# Altium project CW342_KintexK410_676.PrjPcb (part 2 of 2)
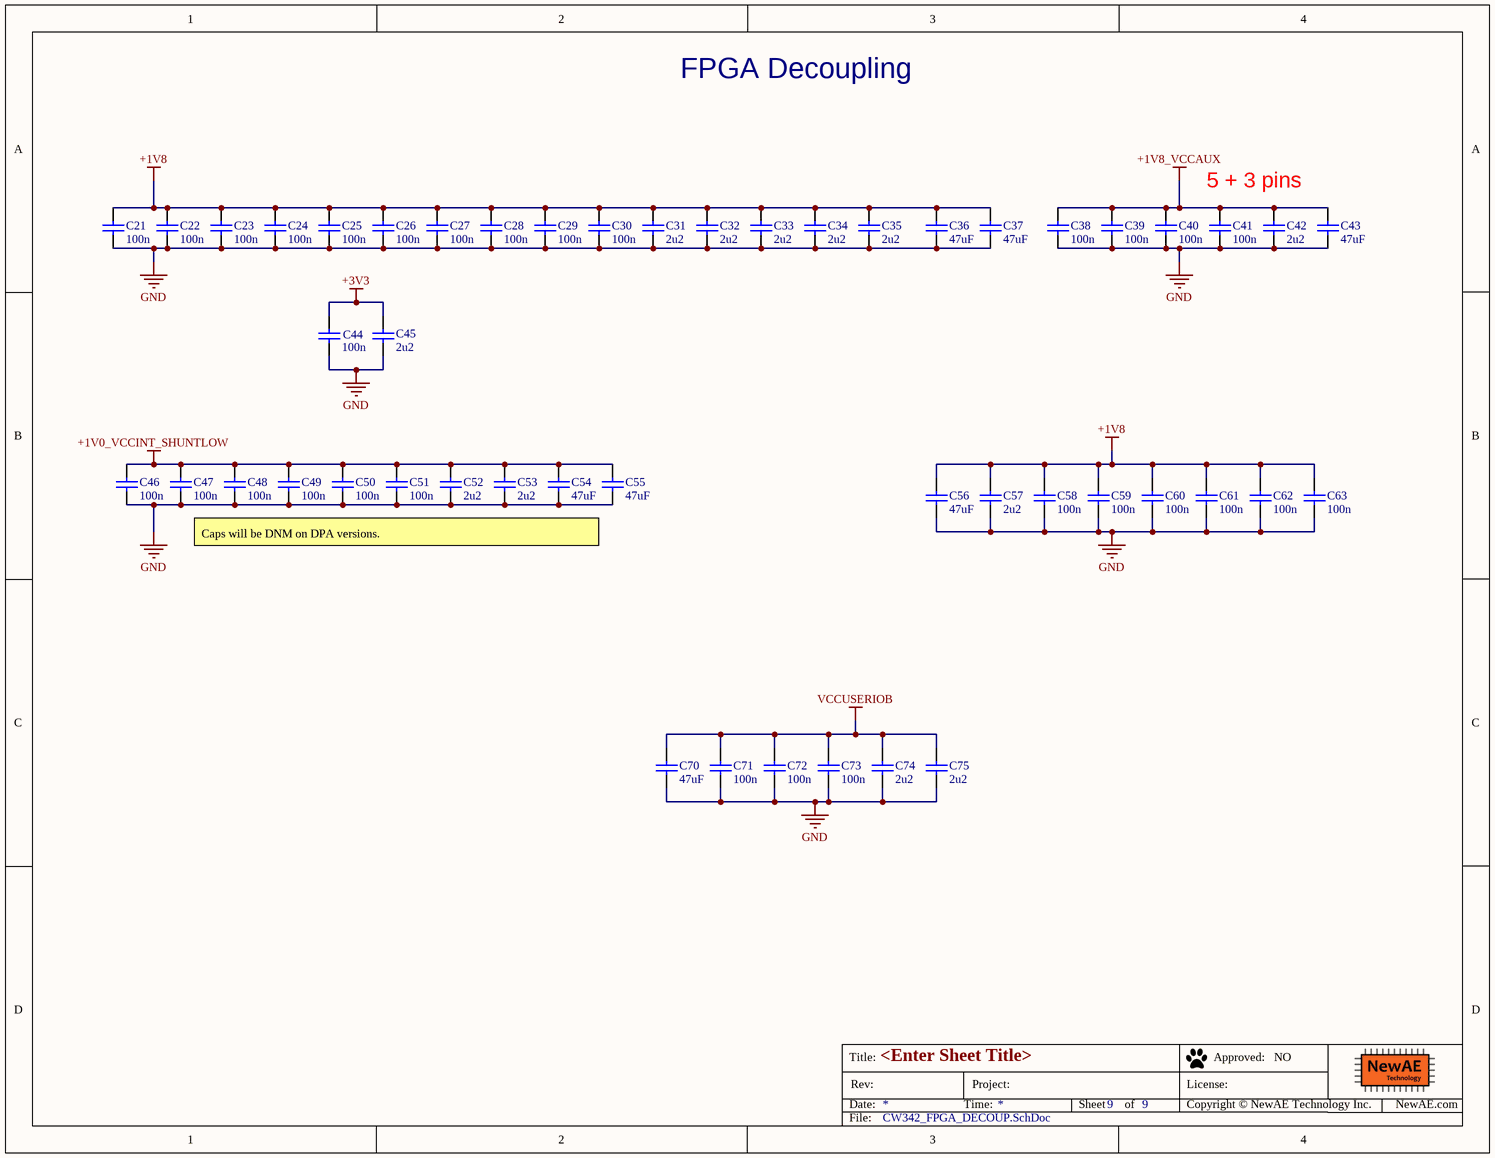
[diagram p9: CW342_FPGA_DECOUP.SchDoc]

## Nets that join several sheets
+1V0_VCCINT_SHUNTLOW: CW342_Edge (PWR1.23 PWR1.24 PWR1.25), CW342_FPGA_PWR (20 pins), CW342_FPGA_DECOUP (10 pins)
+1V8: CW342_Edge (P1.A7 P1.A8), CW342_FPGA_CFG (J1.2), CW342_FPGA_PWR (53 pins), CW342_FPGA_DECOUP (31 pins)
+1V85_XADC_VCC: CW342_XADC (7 pins), CW342_FPGA_PWR (C20.1 U5.M12)
+3V3: CW342_Edge (P1.A3 P1.A4), CW342_XADC (C1.1 L1.1), CW342_FPGA_DECOUP (C44.1 C45.1)
GND: CW342_Edge (42 pins), CW342_XADC (C1.2 L2.1), CW342_FPGAIO_1 (R15.2 R?.2), CW342_FPGA_MGT (U5.M5 U5.M6), CW342_FPGA_CFG (8 pins), CW342_FPGA_PWR (121 pins), CW342_FPGA_DECOUP (49 pins)
VCCUSERIOB: CW342_Edge (P1.B11), CW342_FPGA_PWR (7 pins), CW342_FPGA_DECOUP (6 pins)
XADC_VREFN: CW342_Edge (P1.A16 P1.B16), CW342_XADC (20 pins), CW342_FPGIO_2 (U5.A17 U5.A19 U5.B16 U5.F15), CW342_FPGA_CFG (C18.2 U5.N11), CW342_FPGA_PWR (C20.2 U5.M11)
/USB_CE: CW342_Edge (P1.A81), CW342_FPGAIO_1 (U5.N26)
/USB_RD: CW342_Edge (P1.A80), CW342_FPGAIO_1 (U5.P26)
AD0P: CW342_XADC (R6.2), CW342_FPGIO_2 (U5.C16)
AD1P: CW342_XADC (R3.2), CW342_FPGIO_2 (U5.B17)
AD3P: CW342_XADC (R12.2), CW342_FPGIO_2 (U5.G15)
AD8P: CW342_XADC (R9.2), CW342_FPGIO_2 (U5.A18)
CFG_CLK: CW342_Edge (P1.A57), CW342_FPGA_CFG (U5.C8)
CFG_D0: CW342_Edge (P1.A59), CW342_FPGAIO_1 (U5.B24)
CFG_D1: CW342_Edge (P1.B61), CW342_FPGAIO_1 (U5.A25)
CFG_D2: CW342_Edge (P1.A60), CW342_FPGAIO_1 (U5.B22)
CFG_D3: CW342_Edge (P1.B62), CW342_FPGAIO_1 (U5.A22)
CFG_D4: CW342_Edge (P1.A61), CW342_FPGAIO_1 (U5.A23)
CFG_D5: CW342_Edge (P1.B63), CW342_FPGAIO_1 (U5.A24)
CFG_D6: CW342_Edge (P1.A62), CW342_FPGAIO_1 (U5.D26)
CFG_D7: CW342_Edge (P1.B64), CW342_FPGAIO_1 (U5.C26)
CFG_D8_A0: CW342_Edge (P1.A63), CW342_FPGAIO_1 (U5.C24)
CFG_D9_A1: CW342_Edge (P1.B65), CW342_FPGAIO_1 (U5.D21)
CFG_D10_A2: CW342_Edge (P1.A64), CW342_FPGAIO_1 (U5.C22)
CFG_D11_A3: CW342_Edge (P1.B66), CW342_FPGAIO_1 (U5.B20)
CFG_D12_A4: CW342_Edge (P1.A65), CW342_FPGAIO_1 (U5.A20)
CFG_D13_A5: CW342_Edge (P1.B67), CW342_FPGAIO_1 (U5.E22)
CFG_D14_A6: CW342_Edge (P1.A66), CW342_FPGAIO_1 (U5.C21)
CFG_D15_A7: CW342_Edge (P1.B68), CW342_FPGAIO_1 (U5.B21)
CFG_DONE: CW342_Edge (P1.A68), CW342_FPGA_CFG (U5.J7)
CFG_EMCCLK: CW342_Edge (P1.B71), CW342_FPGAIO_1 (U5.B26)
CFG_INITB: CW342_Edge (P1.A70), CW342_FPGA_CFG (U5.G7)
CFG_PGM: CW342_Edge (P1.A69), CW342_FPGA_CFG (U5.P6)
CFG_RDWR: CW342_Edge (P1.A78), CW342_FPGAIO_1 (U5.E25)
CWIO_HS1: CW342_Edge (P1.A27), CW342_FPGIO_2 (U5.J8)
CWIO_HS2: CW342_Edge (P1.B27), CW342_FPGIO_2 (U5.C12)
CWIO_IO4: CW342_Edge (P1.B26), CW342_FPGIO_2 (U5.A8)
FPGA_M0: CW342_Edge (P1.B79), CW342_FPGA_CFG (U5.T5)
FPGA_M1: CW342_Edge (P1.B80), CW342_FPGA_CFG (U5.T2)
FPGA_M2: CW342_Edge (P1.B81), CW342_FPGA_CFG (U5.P5)
OT_ADC1: CW342_Edge (P1.B12), CW342_XADC (R4.1)
OT_ADC2: CW342_Edge (P1.B13), CW342_XADC (R7.1)
OT_ANALOG0_ADC3: CW342_Edge (P1.B14), CW342_XADC (R10.1)
OT_ANALOG1_ADC4: CW342_Edge (P1.B15), CW342_XADC (R13.1)
OT_IOA0: CW342_Edge (P1.A29), CW342_FPGAIO_3 (U5.AD8)
OT_IOA1: CW342_Edge (P1.B29), CW342_FPGAIO_3 (U5.AC7)
OT_IOA2: CW342_Edge (P1.A30), CW342_FPGAIO_3 (U5.AE7)
OT_IOA3: CW342_Edge (P1.B30), CW342_FPGAIO_3 (U5.AF7)
OT_IOA4: CW342_Edge (P1.A31), CW342_FPGAIO_3 (U5.AF8)
OT_IOA5: CW342_Edge (P1.B31), CW342_FPGAIO_3 (U5.AB9)
OT_IOA6: CW342_Edge (P1.A32), CW342_FPGAIO_3 (U5.AF9)
OT_IOA7: CW342_Edge (P1.B32), CW342_FPGAIO_3 (U5.AE8)
OT_IOA8: CW342_Edge (P1.A33), CW342_FPGAIO_3 (U5.AB7)
OT_IOB0: CW342_Edge (P1.A18), CW342_FPGIO_2 (U5.D14)
OT_IOB1: CW342_Edge (P1.B18), CW342_FPGIO_2 (U5.C13)
OT_IOB2: CW342_Edge (P1.A19), CW342_FPGIO_2 (U5.B15)
OT_IOB3: CW342_Edge (P1.B19), CW342_FPGIO_2 (U5.A15)
OT_IOB4: CW342_Edge (P1.A20), CW342_FPGIO_2 (U5.C14)
OT_IOB5: CW342_Edge (P1.B20), CW342_FPGIO_2 (U5.A14)
OT_IOB6: CW342_Edge (P1.A21), CW342_FPGIO_2 (U5.B14)
OT_IOB7: CW342_Edge (P1.B21), CW342_FPGIO_2 (U5.A13)
OT_IOB8: CW342_Edge (P1.A22), CW342_FPGIO_2 (U5.B12)
OT_IOB9: CW342_Edge (P1.B22), CW342_FPGIO_2 (U5.A12)
OT_IOB10: CW342_Edge (P1.A23), CW342_FPGIO_2 (U5.B11)
OT_IOB11: CW342_Edge (P1.B23), CW342_FPGIO_2 (U5.C11)
OT_IOB12: CW342_Edge (P1.A24), CW342_FPGIO_2 (U5.A10)
OT_IOC0: CW342_Edge (P1.A50), CW342_FPGAIO_1 (U5.AD25)
OT_IOC1: CW342_Edge (P1.B50), CW342_FPGAIO_1 (U5.AC26)
OT_IOC2: CW342_Edge (P1.A51), CW342_FPGAIO_1 (U5.AC24)
OT_IOC3: CW342_Edge (P1.B51), CW342_FPGAIO_1 (U5.AB26)
OT_IOC4: CW342_Edge (P1.A52), CW342_FPGAIO_1 (U5.AB25)
OT_IOC5: CW342_Edge (P1.B52), CW342_FPGAIO_1 (U5.AA25)
OT_IOC6: CW342_Edge (P1.B53), CW342_FPGAIO_1 (U5.Y25)
OT_IOC7: CW342_Edge (P1.B54), CW342_FPGAIO_1 (U5.W26)
OT_IOC8: CW342_Edge (P1.B55), CW342_FPGAIO_1 (U5.W25)
OT_IOC9: CW342_Edge (P1.B56), CW342_FPGAIO_1 (U5.V26)
OT_IOC10: CW342_Edge (P1.B57), CW342_FPGAIO_1 (U5.V24)
OT_IOC11: CW342_Edge (P1.B58), CW342_FPGAIO_1 (U5.U26)
OT_IOC12: CW342_Edge (P1.B59), CW342_FPGAIO_1 (U5.U25)
OT_IOR0_USR_DBG_TMS: CW342_Edge (P1.A42), CW342_FPGAIO_1 (U5.AB24)
OT_IOR1_USR_DBG_TDO: CW342_Edge (P1.B42), CW342_FPGAIO_1 (U5.AD21)
OT_IOR2_USR_DBG_TDI: CW342_Edge (P1.A43), CW342_FPGAIO_1 (U5.V22)
OT_IOR3_USR_DBG_TCK: CW342_Edge (P1.B43), CW342_FPGAIO_1 (U5.AE21)
OT_IOR4_USR_DBG_TRST: CW342_Edge (P1.A44), CW342_FPGAIO_1 (U5.AA24)
OT_IOR5: CW342_Edge (P1.B44), CW342_FPGAIO_1 (U5.AF22)
OT_IOR6: CW342_Edge (P1.A45), CW342_FPGAIO_1 (U5.AE22)
OT_IOR7: CW342_Edge (P1.B45), CW342_FPGAIO_1 (U5.AF23)
OT_IOR8: CW342_Edge (P1.A46), CW342_FPGAIO_1 (U5.AE23)
OT_IOR9: CW342_Edge (P1.B46), CW342_FPGAIO_1 (U5.AF24)
OT_IOR10: CW342_Edge (P1.A47), CW342_FPGAIO_1 (U5.AF25)
OT_IOR11: CW342_Edge (P1.B47), CW342_FPGAIO_1 (U5.AE26)
OT_IOR12: CW342_Edge (P1.A48), CW342_FPGAIO_1 (U5.AE25)
OT_IOR13: CW342_Edge (P1.B48), CW342_FPGAIO_1 (U5.AD26)
OT_PORN: CW342_Edge (P1.A53), CW342_FPGAIO_1 (U5.Y26)
OT_SPI_DEV_CLK: CW342_Edge (P1.A35), CW342_FPGAIO_3 (U5.AD10)
OT_SPI_DEV_CS_L: CW342_Edge (P1.A40), CW342_FPGAIO_3 (U5.AA13)
OT_SPI_DEV_D0: CW342_Edge (P1.A36), CW342_FPGAIO_3 (U5.AE10)
OT_SPI_DEV_D1: CW342_Edge (P1.A37), CW342_FPGAIO_3 (U5.AC11)
OT_SPI_DEV_D2: CW342_Edge (P1.A38), CW342_FPGAIO_3 (U5.AF12)
OT_SPI_DEV_D3: CW342_Edge (P1.A39), CW342_FPGAIO_3 (U5.AF13)
OT_SPI_HOST_CLK: CW342_Edge (P1.B35), CW342_FPGAIO_3 (U5.AD11)
OT_SPI_HOST_CS_L: CW342_Edge (P1.B40), CW342_FPGAIO_3 (U5.AE13)
OT_SPI_HOST_D0: CW342_Edge (P1.B36), CW342_FPGAIO_3 (U5.AF10)
OT_SPI_HOST_D1: CW342_Edge (P1.B37), CW342_FPGAIO_3 (U5.AC12)
OT_SPI_HOST_D2: CW342_Edge (P1.B38), CW342_FPGAIO_3 (U5.AE11)
OT_SPI_HOST_D3: CW342_Edge (P1.B39), CW342_FPGAIO_3 (U5.AE12)
PLL_CLK1: CW342_Edge (P1.A55), CW342_FPGAIO_1 (U5.Y23)
PLL_CLK2: CW342_Edge (P1.B33), CW342_FPGAIO_3 (U5.AC9)
PMOD2_IO4_3V3: CW342_Edge (P1.A25), CW342_FPGIO_2 (U5.B10)
PMOD2_IO7_3V3: CW342_Edge (P1.B25), CW342_FPGIO_2 (U5.A9)
PMOD2_IO8_3V3: CW342_Edge (P1.A26), CW342_FPGIO_2 (U5.B9)
USB_CLK0: CW342_Edge (P1.A79), CW342_FPGAIO_1 (U5.P21)
USR_DBG_nRST: CW342_Edge (P1.B41), CW342_FPGAIO_1 (U5.U22)
USRUSB_OE: CW342_Edge (P1.B77), CW342_FPGIO_2 (U5.AF20)
USRUSB_PWREN: CW342_Edge (P1.A72), CW342_FPGIO_2 (U5.AF17)
USRUSB_RCV: CW342_Edge (P1.A76), CW342_FPGIO_2 (U5.AD20)
USRUSB_SOFTCN: CW342_Edge (P1.B75), CW342_FPGIO_2 (U5.AC19)
USRUSB_SPD: CW342_Edge (P1.B76), CW342_FPGIO_2 (U5.AB20)
USRUSB_SUS: CW342_Edge (P1.B78), CW342_FPGIO_2 (U5.AF18)
USRUSB_VBUS_DETECT: CW342_Edge (P1.A73), CW342_FPGIO_2 (U5.AE17)
USRUSB_VM: CW342_Edge (P1.A74), CW342_FPGIO_2 (U5.AE18)
USRUSB_VMO: CW342_Edge (P1.B74), CW342_FPGIO_2 (U5.AD19)
USRUSB_VP: CW342_Edge (P1.A75), CW342_FPGIO_2 (U5.AE20)
USRUSB_VPO: CW342_Edge (P1.B73), CW342_FPGIO_2 (U5.AF19)
XADC_DXN: CW342_Edge (P1.A15), CW342_FPGA_CFG (U5.R11)
XADC_DXP: CW342_Edge (P1.A14), CW342_FPGA_CFG (U5.R12)
XADC_VREFP: CW342_XADC (C5.1 U1.2), CW342_FPGA_CFG (C18.1 U5.P12)